# Altium schematic sheet PCF8574.SchDoc
size A4; SheetNumber: 3; SheetTotal: 3
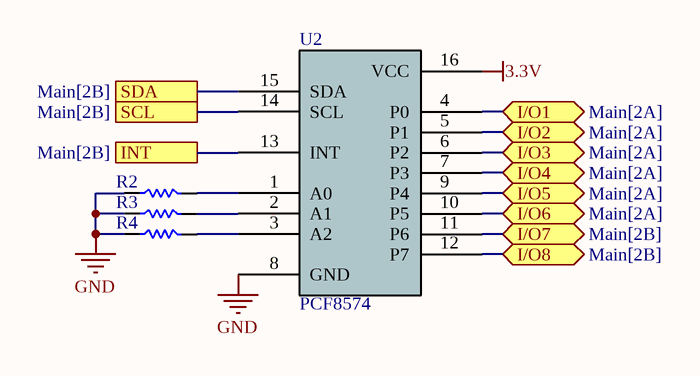
[diagram p0: PCF8574.SchDoc]

## Parts
R2  10K  [R 0805]  (value not drawn)
R3  10K  [R 0805]  (value not drawn)
R4  10K  [R 0805]  (value not drawn)
U2  PCF8574  [SOP16W_M]

## Ports
I/O1 (bidir, see Main[2A]), I/O2 (bidir, see Main[2A]), I/O3 (bidir, see Main[2A]), I/O4 (bidir, see Main[2A]), I/O5 (bidir, see Main[2A]), I/O6 (bidir, see Main[2A]), I/O7 (bidir, see Main[2B]), I/O8 (bidir, see Main[2B]), INT (see Main[2B]), SCL (see Main[2B]), SDA (see Main[2B])

## Nets
3.3V: U2.16(VCC)
GND: R2.1 R3.1 R4.1 U2.8(GND)
I/O1: U2.4(P0) ; port I/O1
I/O2: U2.5(P1) ; port I/O2
I/O3: U2.6(P2) ; port I/O3
I/O4: U2.7(P3) ; port I/O4
I/O5: U2.9(P4) ; port I/O5
I/O6: U2.10(P5) ; port I/O6
I/O7: U2.11(P6) ; port I/O7
I/O8: U2.12(P7) ; port I/O8
INT: U2.13(INT) ; port INT
SCL: U2.14(SCL) ; port SCL
SDA: U2.15(SDA) ; port SDA
NetR2_2: R2.2 U2.1(A0)
NetR3_2: R3.2 U2.2(A1)
NetR4_2: R4.2 U2.3(A2)

## Library data of the parts
R2-R4 = R: Chip resistor; 版权归属: 源创客; BOM名称: Chip resistor; 学习资源: www.ooocke.com
U2 = PCF8574: Remote 8-Bit I/O Expander for I  2C Bus